# Altium schematic sheet 01_FPGA.SchDoc
size A2
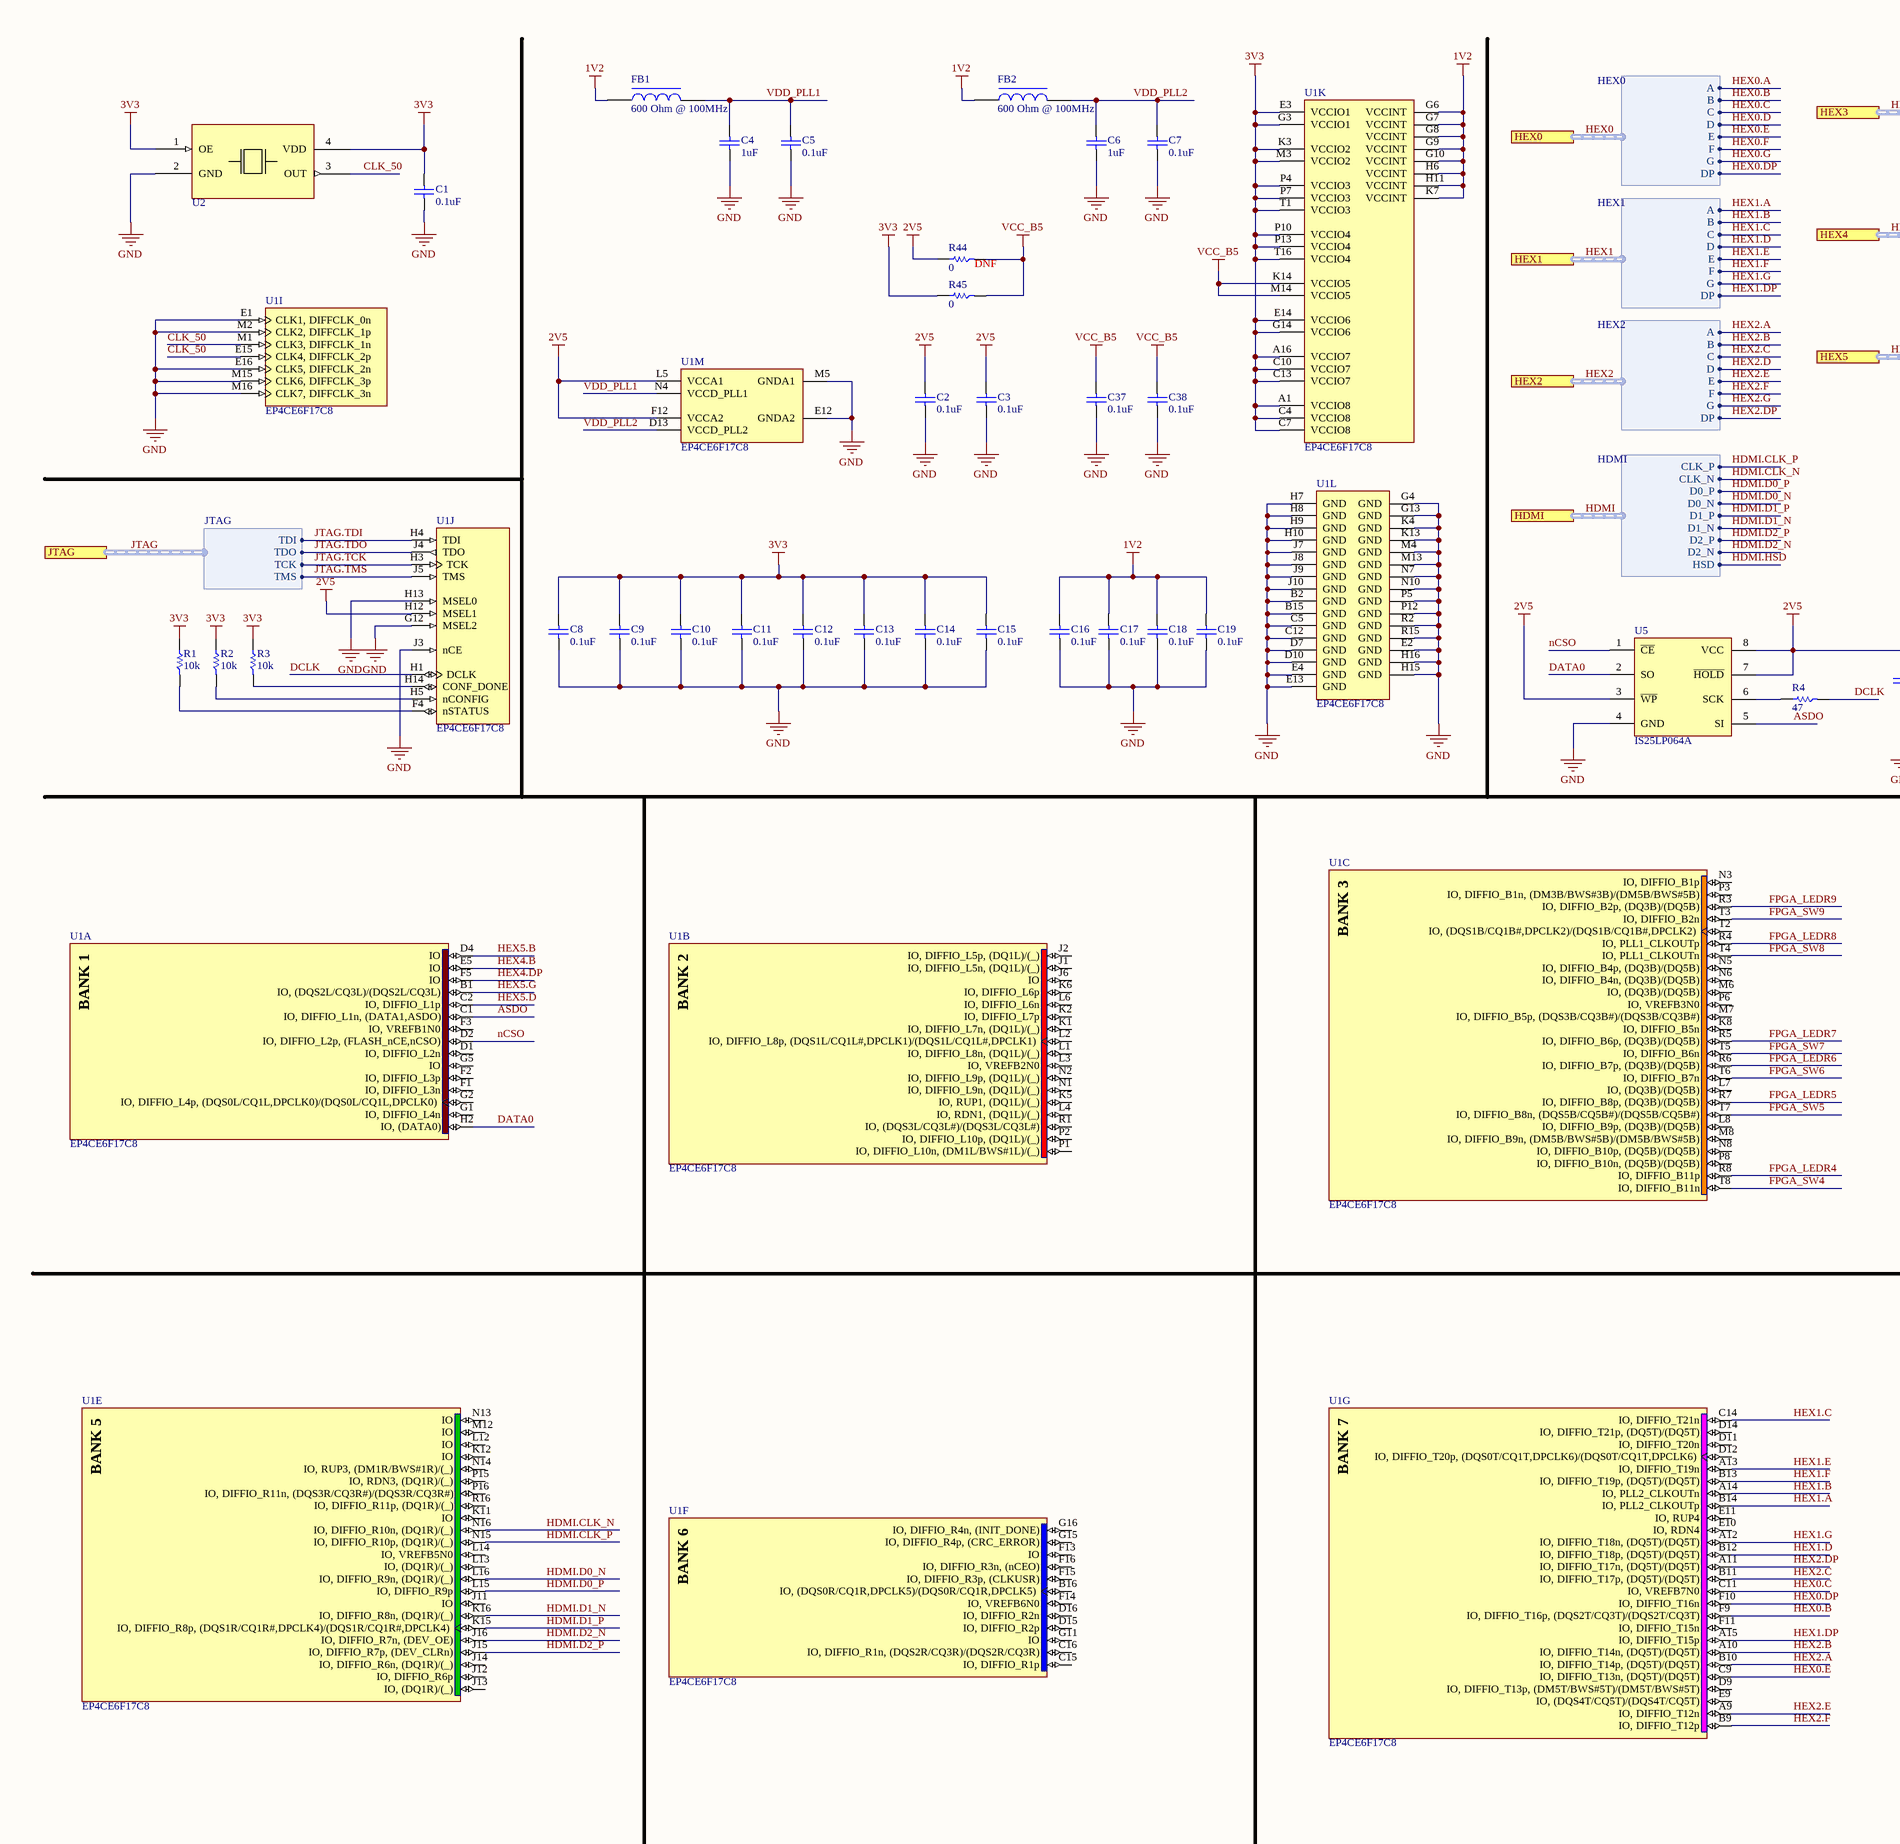
[diagram p0: 01_FPGA.SchDoc, left]
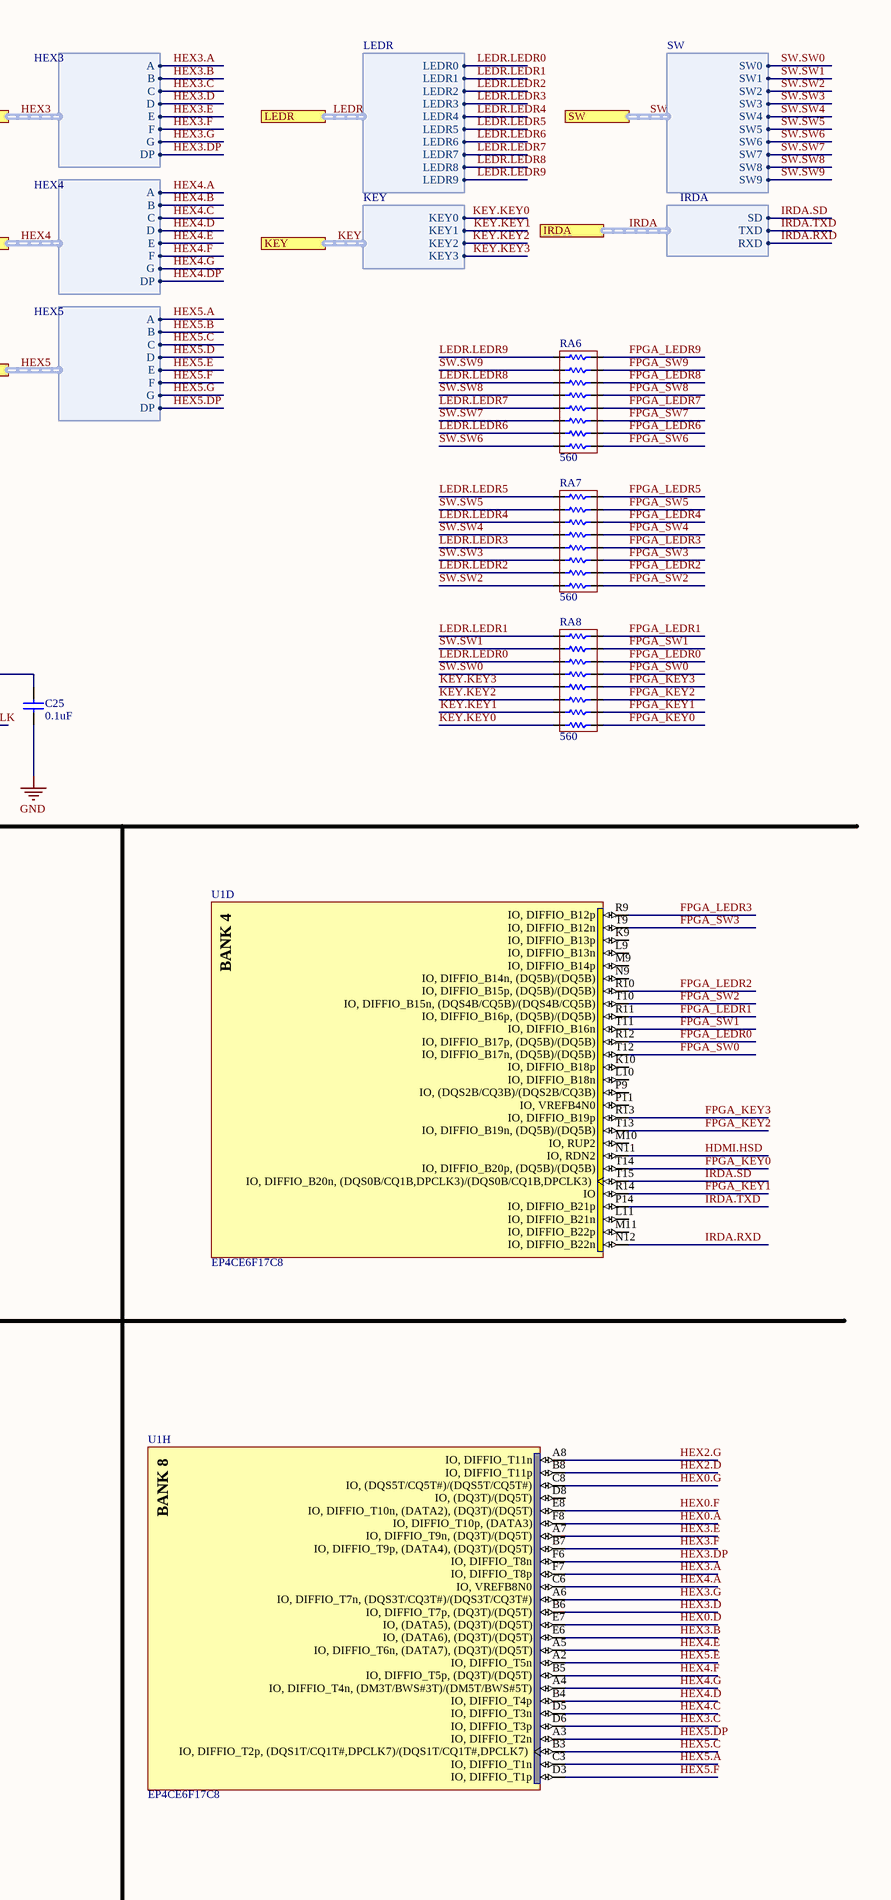
[diagram p1: 01_FPGA.SchDoc, right]

## Parts
C1  0.1uF  [CAP0603R]
C2  0.1uF  [CAP0603R]
C3  0.1uF  [CAP0603R]
C4  1uF  [CAP0603R]
C5  0.1uF  [CAP0603R]
C6  1uF  [CAP0603R]
C7  0.1uF  [CAP0603R]
C8  0.1uF  [CAP0603R]
C9  0.1uF  [CAP0603R]
C10  0.1uF  [CAP0603R]
C11  0.1uF  [CAP0603R]
C12  0.1uF  [CAP0603R]
C13  0.1uF  [CAP0603R]
C14  0.1uF  [CAP0603R]
C15  0.1uF  [CAP0603R]
C16  0.1uF  [CAP0603R]
C17  0.1uF  [CAP0603R]
C18  0.1uF  [CAP0603R]
C19  0.1uF  [CAP0603R]
C25  0.1uF  [CAP0603R]
C37  0.1uF  [CAP0603R]
C38  0.1uF  [CAP0603R]
FB1  600 Ohm @ 100MHz  [RES0805R]
FB2  600 Ohm @ 100MHz  [RES0805R]
R1  10k  [RES0603R]
R2  10k  [RES0603R]
R3  10k  [RES0603R]
R4  47  [RES0603R]
R44  Load: DNF  [RES0402R]  (hidden comment: 0)
R45  0  [RES0402R]
RA6  value 560  [EXB-2HV]  (hidden comment: Resistor Array)
RA7  value 560  [EXB-2HV]  (hidden comment: Resistor Array)
RA8  value 560  [EXB-2HV]  (hidden comment: Resistor Array)
U1  EP4CE6F17C8  [FBGA256]  (parts A,B,C,D,E,F,G,H,I,J,K,L,M of 13)
U2  Oscillator  [CRYSTAL_7x5]  (value not drawn)
U5  IS25LP064A  [SOIC-8]

## Ports
HDMI (harness HDMI), HEX0 (harness HEX0), HEX1 (harness HEX1), HEX2 (harness HEX2), HEX3 (harness HEX3), HEX4 (harness HEX4), HEX5 (harness HEX5), IRDA (harness IRDA), JTAG (harness JTAG), KEY (harness KEY), LEDR (harness LEDR), SW (harness SW)

## Harnesses
JTAG: TDI, TDO, TCK, TMS
LEDR: LEDR0, LEDR1, LEDR2, LEDR3, LEDR4, LEDR5, LEDR6, LEDR7, LEDR8, LEDR9
SW: SW0, SW1, SW2, SW3, SW4, SW5, SW6, SW7, SW8, SW9
KEY: KEY0, KEY1, KEY2, KEY3
HEX0: A, B, C, D, E, F, G, DP
HEX1: A, B, C, D, E, F, G, DP
HEX2: A, B, C, D, E, F, G, DP
HEX3: A, B, C, D, E, F, G, DP
HEX4: A, B, C, D, E, F, G, DP
HEX5: A, B, C, D, E, F, G, DP
HDMI: CLK_P, CLK_N, D0_P, D0_N, D1_P, D1_N, D2_P, D2_N, HSD
IRDA: SD, TXD, RXD

## Nets
1V2: C16.1 C17.1 C18.1 C19.1 FB1.1 FB2.1 U1.G6(VCCINT) U1.G7(VCCINT) U1.G8(VCCINT) U1.G9(VCCINT) U1.G10(VCCINT) U1.H6(VCCINT) U1.H11(VCCINT) U1.K7(VCCINT)
2V5: C2.1 C3.1 C25.1 R44.2 U1.F12(VCCA2) U1.H12(MSEL1) U1.L5(VCCA1) U5.3(~{WP}) U5.7(~{HOLD}) U5.8(VCC)
3V3: C1.1 C8.1 C9.1 C10.1 C11.1 C12.1 C13.1 C14.1 C15.1 R1.2 R2.2 R3.2 R45.2 U1.A1(VCCIO8) U1.A16(VCCIO7) U1.C4(VCCIO8) U1.C7(VCCIO8) U1.C10(VCCIO7) U1.C13(VCCIO7) U1.E3(VCCIO1) U1.E14(VCCIO6) U1.G3(VCCIO1) U1.G14(VCCIO6) U1.K3(VCCIO2) U1.M3(VCCIO2) U1.P4(VCCIO3) U1.P7(VCCIO3) U1.P10(VCCIO4) U1.P13(VCCIO4) U1.T1(VCCIO3) U1.T16(VCCIO4) U2.1(OE) U2.4(VDD)
GND: C1.2 C2.2 C3.2 C4.2 C5.2 C6.2 C7.2 C8.2 C9.2 C10.2 C11.2 C12.2 C13.2 C14.2 C15.2 C16.2 C17.2 C18.2 C19.2 C25.2 C37.2 C38.2 U1.B2(GND) U1.B15(GND) U1.C5(GND) U1.C12(GND) U1.D7(GND) U1.D10(GND) U1.E1(CLK1,_DIFFCLK_0n) U1.E2(GND) U1.E4(GND) U1.E12(GNDA2) U1.E13(GND) U1.E16(CLK5,_DIFFCLK_2n) U1.G4(GND) U1.G12(MSEL2) U1.G13(GND) U1.H7(GND) U1.H8(GND) U1.H9(GND) U1.H10(GND) U1.H13(MSEL0) U1.H15(GND) U1.H16(GND) U1.J3(nCE) U1.J7(GND) U1.J8(GND) U1.J9(GND) U1.J10(GND) U1.K4(GND) U1.K13(GND) U1.M2(CLK2,_DIFFCLK_1p) U1.M4(GND) U1.M5(GNDA1) U1.M13(GND) U1.M15(CLK6,_DIFFCLK_3p) U1.M16(CLK7,_DIFFCLK_3n) U1.N7(GND) U1.N10(GND) U1.P5(GND) U1.P12(GND) U1.R2(GND) U1.R15(GND) U2.2(GND) U5.4(GND)
VCC_B5: C37.1 C38.1 R44.1 R45.1 U1.K14(VCCIO5) U1.M14(VCCIO5)
ASDO: U1.C1(IO,_DIFFIO_L1n,_(DATA1,ASDO)) U5.5(SI)
CLK_50: U1.E15(CLK4,_DIFFCLK_2p) U1.M1(CLK3,_DIFFCLK_1n) U2.3(OUT)
DATA0: U1.H2(IO,_(DATA0)) U5.2(SO)
DCLK: R4.1 U1.H1(DCLK)
FPGA_KEY0: RA8.9 U1.T14(IO,_DIFFIO_B20p,_(DQ5B)/(DQ5B))
FPGA_KEY1: RA8.10 U1.R14(IO)
FPGA_KEY2: RA8.11 U1.T13(IO,_DIFFIO_B19n,_(DQ5B)/(DQ5B))
FPGA_KEY3: RA8.12 U1.R13(IO,_DIFFIO_B19p)
FPGA_LEDR0: RA8.14 U1.R12(IO,_DIFFIO_B17p,_(DQ5B)/(DQ5B))
FPGA_LEDR1: RA8.16 U1.R11(IO,_DIFFIO_B16p,_(DQ5B)/(DQ5B))
FPGA_LEDR2: RA7.10 U1.R10(IO,_DIFFIO_B15p,_(DQ5B)/(DQ5B))
FPGA_LEDR3: RA7.12 U1.R9(IO,_DIFFIO_B12p)
FPGA_LEDR4: RA7.14 U1.R8(IO,_DIFFIO_B11p)
FPGA_LEDR5: RA7.16 U1.R7(IO,_DIFFIO_B8p,_(DQ3B)/(DQ5B))
FPGA_LEDR6: RA6.10 U1.R6(IO,_DIFFIO_B7p,_(DQ3B)/(DQ5B))
FPGA_LEDR7: RA6.12 U1.R5(IO,_DIFFIO_B6p,_(DQ3B)/(DQ5B))
FPGA_LEDR8: RA6.14 U1.R4(IO,_PLL1_CLKOUTp)
FPGA_LEDR9: RA6.16 U1.R3(IO,_DIFFIO_B2p,_(DQ3B)/(DQ5B))
FPGA_SW0: RA8.13 U1.T12(IO,_DIFFIO_B17n,_(DQ5B)/(DQ5B))
FPGA_SW1: RA8.15 U1.T11(IO,_DIFFIO_B16n)
FPGA_SW2: RA7.9 U1.T10(IO,_DIFFIO_B15n,_(DQS4B/CQ5B)/(DQS4B/CQ5B))
FPGA_SW3: RA7.11 U1.T9(IO,_DIFFIO_B12n)
FPGA_SW4: RA7.13 U1.T8(IO,_DIFFIO_B11n)
FPGA_SW5: RA7.15 U1.T7(IO,_DIFFIO_B8n,_(DQS5B/CQ5B#)/(DQS5B/CQ5B#))
FPGA_SW6: RA6.9 U1.T6(IO,_DIFFIO_B7n)
FPGA_SW7: RA6.11 U1.T5(IO,_DIFFIO_B6n)
FPGA_SW8: RA6.13 U1.T4(IO,_PLL1_CLKOUTn)
FPGA_SW9: RA6.15 U1.T3(IO,_DIFFIO_B2n)
HDMI.CLK_N: U1.N16(IO,_DIFFIO_R10n,_(DQ1R)/(_)) ; port HDMI.CLK_N
HDMI.CLK_P: U1.N15(IO,_DIFFIO_R10p,_(DQ1R)/(_)) ; port HDMI.CLK_P
HDMI.D0_N: U1.L16(IO,_DIFFIO_R9n,_(DQ1R)/(_)) ; port HDMI.D0_N
HDMI.D0_P: U1.L15(IO,_DIFFIO_R9p) ; port HDMI.D0_P
HDMI.D1_N: U1.K16(IO,_DIFFIO_R8n,_(DQ1R)/(_)) ; port HDMI.D1_N
HDMI.D1_P: U1.K15(IO,_DIFFIO_R8p,_(DQS1R/CQ1R#,DPCLK4)/(DQS1R/CQ1R#,DPCLK4)) ; port HDMI.D1_P
HDMI.D2_N: U1.J16(IO,_DIFFIO_R7n,_(DEV_OE)) ; port HDMI.D2_N
HDMI.D2_P: U1.J15(IO,_DIFFIO_R7p,_(DEV_CLRn)) ; port HDMI.D2_P
HDMI.HSD: U1.N11(IO,_RDN2) ; port HDMI.HSD
HEX0.A: U1.F8(IO,_DIFFIO_T10p,_(DATA3)) ; port HEX0.A
HEX0.B: U1.F9(IO,_DIFFIO_T16p,_(DQS2T/CQ3T)/(DQS2T/CQ3T)) ; port HEX0.B
HEX0.C: U1.C11(IO,_VREFB7N0) ; port HEX0.C
HEX0.D: U1.E7(IO,_(DATA5),_(DQ3T)/(DQ5T)) ; port HEX0.D
HEX0.DP: U1.F10(IO,_DIFFIO_T16n) ; port HEX0.DP
HEX0.E: U1.C9(IO,_DIFFIO_T13n,_(DQ5T)/(DQ5T)) ; port HEX0.E
HEX0.F: U1.E8(IO,_DIFFIO_T10n,_(DATA2),_(DQ3T)/(DQ5T)) ; port HEX0.F
HEX0.G: U1.C8(IO,_(DQS5T/CQ5T#)/(DQS5T/CQ5T#)) ; port HEX0.G
HEX1.A: U1.B14(IO,_PLL2_CLKOUTp) ; port HEX1.A
HEX1.B: U1.A14(IO,_PLL2_CLKOUTn) ; port HEX1.B
HEX1.C: U1.C14(IO,_DIFFIO_T21n) ; port HEX1.C
HEX1.D: U1.B12(IO,_DIFFIO_T18p,_(DQ5T)/(DQ5T)) ; port HEX1.D
HEX1.DP: U1.A15(IO,_DIFFIO_T15p) ; port HEX1.DP
HEX1.E: U1.A13(IO,_DIFFIO_T19n) ; port HEX1.E
HEX1.F: U1.B13(IO,_DIFFIO_T19p,_(DQ5T)/(DQ5T)) ; port HEX1.F
HEX1.G: U1.A12(IO,_DIFFIO_T18n,_(DQ5T)/(DQ5T)) ; port HEX1.G
HEX2.A: U1.B10(IO,_DIFFIO_T14p,_(DQ5T)/(DQ5T)) ; port HEX2.A
HEX2.B: U1.A10(IO,_DIFFIO_T14n,_(DQ5T)/(DQ5T)) ; port HEX2.B
HEX2.C: U1.B11(IO,_DIFFIO_T17p,_(DQ5T)/(DQ5T)) ; port HEX2.C
HEX2.D: U1.B8(IO,_DIFFIO_T11p) ; port HEX2.D
HEX2.DP: U1.A11(IO,_DIFFIO_T17n,_(DQ5T)/(DQ5T)) ; port HEX2.DP
HEX2.E: U1.A9(IO,_DIFFIO_T12n) ; port HEX2.E
HEX2.F: U1.B9(IO,_DIFFIO_T12p) ; port HEX2.F
HEX2.G: U1.A8(IO,_DIFFIO_T11n) ; port HEX2.G
HEX3.A: U1.F7(IO,_DIFFIO_T8p) ; port HEX3.A
HEX3.B: U1.E6(IO,_(DATA6),_(DQ3T)/(DQ5T)) ; port HEX3.B
HEX3.C: U1.D6(IO,_DIFFIO_T3p) ; port HEX3.C
HEX3.D: U1.B6(IO,_DIFFIO_T7p,_(DQ3T)/(DQ5T)) ; port HEX3.D
HEX3.DP: U1.F6(IO,_DIFFIO_T8n) ; port HEX3.DP
HEX3.E: U1.A7(IO,_DIFFIO_T9n,_(DQ3T)/(DQ5T)) ; port HEX3.E
HEX3.F: U1.B7(IO,_DIFFIO_T9p,_(DATA4),_(DQ3T)/(DQ5T)) ; port HEX3.F
HEX3.G: U1.A6(IO,_DIFFIO_T7n,_(DQS3T/CQ3T#)/(DQS3T/CQ3T#)) ; port HEX3.G
HEX4.A: U1.C6(IO,_VREFB8N0) ; port HEX4.A
HEX4.B: U1.E5(IO) ; port HEX4.B
HEX4.C: U1.D5(IO,_DIFFIO_T3n) ; port HEX4.C
HEX4.D: U1.B4(IO,_DIFFIO_T4p) ; port HEX4.D
HEX4.DP: U1.F5(IO) ; port HEX4.DP
HEX4.E: U1.A5(IO,_DIFFIO_T6n,_(DATA7),_(DQ3T)/(DQ5T)) ; port HEX4.E
HEX4.F: U1.B5(IO,_DIFFIO_T5p,_(DQ3T)/(DQ5T)) ; port HEX4.F
HEX4.G: U1.A4(IO,_DIFFIO_T4n,_(DM3T/BWS#3T)/(DM5T/BWS#5T)) ; port HEX4.G
HEX5.A: U1.C3(IO,_DIFFIO_T1n) ; port HEX5.A
HEX5.B: U1.D4(IO) ; port HEX5.B
HEX5.C: U1.B3(IO,_DIFFIO_T2p,_(DQS1T/CQ1T#,DPCLK7)/(DQS1T/CQ1T#,DPCLK7)) ; port HEX5.C
HEX5.D: U1.C2(IO,_DIFFIO_L1p) ; port HEX5.D
HEX5.DP: U1.A3(IO,_DIFFIO_T2n) ; port HEX5.DP
HEX5.E: U1.A2(IO,_DIFFIO_T5n) ; port HEX5.E
HEX5.F: U1.D3(IO,_DIFFIO_T1p) ; port HEX5.F
HEX5.G: U1.B1(IO,_(DQS2L/CQ3L)/(DQS2L/CQ3L)) ; port HEX5.G
IRDA.RXD: U1.N12(IO,_DIFFIO_B22n) ; port IRDA.RXD
IRDA.SD: U1.T15(IO,_DIFFIO_B20n,_(DQS0B/CQ1B,DPCLK3)/(DQS0B/CQ1B,DPCLK3)) ; port IRDA.SD
IRDA.TXD: U1.P14(IO,_DIFFIO_B21p) ; port IRDA.TXD
JTAG.TCK: U1.H3(TCK) ; port JTAG.TCK
JTAG.TDI: U1.H4(TDI) ; port JTAG.TDI
JTAG.TDO: U1.J4(TDO) ; port JTAG.TDO
JTAG.TMS: U1.J5(TMS) ; port JTAG.TMS
KEY.KEY0: RA8.8 ; port KEY.KEY0
KEY.KEY1: RA8.7 ; port KEY.KEY1
KEY.KEY2: RA8.6 ; port KEY.KEY2
KEY.KEY3: RA8.5 ; port KEY.KEY3
LEDR.LEDR0: RA8.3 ; port LEDR.LEDR0
LEDR.LEDR1: RA8.1 ; port LEDR.LEDR1
LEDR.LEDR2: RA7.7 ; port LEDR.LEDR2
LEDR.LEDR3: RA7.5 ; port LEDR.LEDR3
LEDR.LEDR4: RA7.3 ; port LEDR.LEDR4
LEDR.LEDR5: RA7.1 ; port LEDR.LEDR5
LEDR.LEDR6: RA6.7 ; port LEDR.LEDR6
LEDR.LEDR7: RA6.5 ; port LEDR.LEDR7
LEDR.LEDR8: RA6.3 ; port LEDR.LEDR8
LEDR.LEDR9: RA6.1 ; port LEDR.LEDR9
nCSO: U1.D2(IO,_DIFFIO_L2p,_(FLASH_nCE,nCSO)) U5.1(~{CE})
SW.SW0: RA8.4 ; port SW.SW0
SW.SW1: RA8.2 ; port SW.SW1
SW.SW2: RA7.8 ; port SW.SW2
SW.SW3: RA7.6 ; port SW.SW3
SW.SW4: RA7.4 ; port SW.SW4
SW.SW5: RA7.2 ; port SW.SW5
SW.SW6: RA6.8 ; port SW.SW6
SW.SW7: RA6.6 ; port SW.SW7
SW.SW8: RA6.4 ; port SW.SW8
SW.SW9: RA6.2 ; port SW.SW9
VDD_PLL1: C4.1 C5.1 FB1.2 U1.N4(VCCD_PLL1)
VDD_PLL2: C6.1 C7.1 FB2.2 U1.D13(VCCD_PLL2)
NetR1_1: R1.1 U1.F4(nSTATUS)
NetR2_1: R2.1 U1.H5(nCONFIG)
NetR3_1: R3.1 U1.H14(CONF_DONE)
NetR4_2: R4.2 U5.6(SCK)

Not connected (* = marked no-connect by the designer): U1 B16(IO,_(DQS0R/CQ1R,DPCLK5)/(DQS0R/CQ1R,DPCLK5)) C15(IO,_DIFFIO_R1p) C16(IO,_DIFFIO_R1n,_(DQS2R/CQ3R)/(DQS2R/CQ3R)) D1(IO,_DIFFIO_L2n) D8(IO,_(DQ3T)/(DQ5T)) D9(IO,_DIFFIO_T13p,_(DM5T/BWS#5T)/(DM5T/BWS#5T)) D11(IO,_DIFFIO_T20n) D12(IO,_DIFFIO_T20p,_(DQS0T/CQ1T,DPCLK6)/(DQS0T/CQ1T,DPCLK6)) D14(IO,_DIFFIO_T21p,_(DQ5T)/(DQ5T)) D15(IO,_DIFFIO_R2p) D16(IO,_DIFFIO_R2n) E9(IO,_(DQS4T/CQ5T)/(DQS4T/CQ5T)) E10(IO,_RDN4) E11(IO,_RUP4) F1(IO,_DIFFIO_L3n) F2(IO,_DIFFIO_L3p) F3(IO,_VREFB1N0) F11(IO,_DIFFIO_T15n) F13(IO) F14(IO,_VREFB6N0) F15(IO,_DIFFIO_R3p,_(CLKUSR)) F16(IO,_DIFFIO_R3n,_(nCEO)) G1(IO,_DIFFIO_L4n) G2(IO,_DIFFIO_L4p,_(DQS0L/CQ1L,DPCLK0)/(DQS0L/CQ1L,DPCLK0)) G5(IO) G11(IO) G15(IO,_DIFFIO_R4p,_(CRC_ERROR)) G16(IO,_DIFFIO_R4n,_(INIT_DONE)) J1(IO,_DIFFIO_L5n,_(DQ1L)/(_)) J2(IO,_DIFFIO_L5p,_(DQ1L)/(_)) J6(IO) J11(IO) J12(IO,_DIFFIO_R6p) J13(IO,_(DQ1R)/(_)) J14(IO,_DIFFIO_R6n,_(DQ1R)/(_)) K1(IO,_DIFFIO_L7n,_(DQ1L)/(_)) K2(IO,_DIFFIO_L7p) K5(IO,_RUP1,_(DQ1L)/(_)) K6(IO,_DIFFIO_L6p) K8(IO,_DIFFIO_B5n) K9(IO,_DIFFIO_B13p) K10(IO,_DIFFIO_B18p) K11(IO) K12(IO) L1(IO,_DIFFIO_L8n,_(DQ1L)/(_)) L2(IO,_DIFFIO_L8p,_(DQS1L/CQ1L#,DPCLK1)/(DQS1L/CQ1L#,DPCLK1)) L3(IO,_VREFB2N0) L4(IO,_RDN1,_(DQ1L)/(_)) L6(IO,_DIFFIO_L6n) L7(IO,_(DQ3B)/(DQ5B)) L8(IO,_DIFFIO_B9p,_(DQ3B)/(DQ5B)) L9(IO,_DIFFIO_B13n) L10(IO,_DIFFIO_B18n) L11(IO,_DIFFIO_B21n) L12(IO) L13(IO,_(DQ1R)/(_)) L14(IO,_VREFB5N0) M6(IO,_(DQ3B)/(DQ5B)) M7(IO,_DIFFIO_B5p,_(DQS3B/CQ3B#)/(DQS3B/CQ3B#)) M8(IO,_DIFFIO_B9n,_(DM5B/BWS#5B)/(DM5B/BWS#5B)) M9(IO,_DIFFIO_B14p) M10(IO,_RUP2) M11(IO,_DIFFIO_B22p) M12(IO) N1(IO,_DIFFIO_L9n,_(DQ1L)/(_)) N2(IO,_DIFFIO_L9p,_(DQ1L)/(_)) N3(IO,_DIFFIO_B1p) N5(IO,_DIFFIO_B4p,_(DQ3B)/(DQ5B)) N6(IO,_DIFFIO_B4n,_(DQ3B)/(DQ5B)) N8(IO,_DIFFIO_B10p,_(DQ5B)/(DQ5B)) N9(IO,_DIFFIO_B14n,_(DQ5B)/(DQ5B)) N13(IO) N14(IO,_RUP3,_(DM1R/BWS#1R)/(_)) P1(IO,_DIFFIO_L10n,_(DM1L/BWS#1L)/(_)) P2(IO,_DIFFIO_L10p,_(DQ1L)/(_)) P3(IO,_DIFFIO_B1n,_(DM3B/BWS#3B)/(DM5B/BWS#5B)) P6(IO,_VREFB3N0) P8(IO,_DIFFIO_B10n,_(DQ5B)/(DQ5B)) P9(IO,_(DQS2B/CQ3B)/(DQS2B/CQ3B)) P11(IO,_VREFB4N0) P15(IO,_RDN3,_(DQ1R)/(_)) P16(IO,_DIFFIO_R11n,_(DQS3R/CQ3R#)/(DQS3R/CQ3R#)) R1(IO,_(DQS3L/CQ3L#)/(DQS3L/CQ3L#)) R16(IO,_DIFFIO_R11p,_(DQ1R)/(_)) T2(IO,_(DQS1B/CQ1B#,DPCLK2)/(DQS1B/CQ1B#,DPCLK2))

## Buses and harness runs
harness HDMI = port HDMI
harness HEX0 = port HEX0
harness HEX1 = port HEX1
harness HEX2 = port HEX2
harness HEX3 = port HEX3
harness HEX4 = port HEX4
harness HEX5 = port HEX5
harness IRDA = port IRDA
harness JTAG = port JTAG
harness KEY = port KEY
harness LEDR = port LEDR
harness SW = port SW

## Notes on the sheet
- (in symbol EP4CE6F17C8, part A) BANK 1
- (in symbol EP4CE6F17C8, part B) BANK 2
- (in symbol EP4CE6F17C8, part C) BANK 3
- (in symbol EP4CE6F17C8, part D) BANK 4
- (in symbol EP4CE6F17C8, part E) BANK 5
- (in symbol EP4CE6F17C8, part F) BANK 6
- (in symbol EP4CE6F17C8, part G) BANK 7
- (in symbol EP4CE6F17C8, part H) BANK 8

## Library data of the parts
C1-C19 C25 C37 C38 = C: Capacitor; Class I: Passive; Load: YES; Revision: July-2002: Re-released for DXP Platform.; Supplier 1: Digi-Key; Mount: SMD
  C1-C3 C5 C7-C19 C25 C37 C38: Supplier Part Number 1: 311-3560-1-ND; Value: 0.1uF
  C4 C6: Supplier Part Number 1: 587-1242-1-ND; Value: 1uF
FB1 FB2 = Ferrite_Bead: Ferrite Bead; Load: YES; Supplier 1: Digi-Key; Supplier Part Number 1: 445-172908-1-ND; Value: 600 Ohm @ 100MHz; Mount: SMD
R1-R4 R45 = R: Resistor; Load: YES; Mount: SMD; Supplier 1: Digi-Key
  R1-R3: Supplier Part Number 1: 311-10.0KHRCT-ND; Value: 10k
  R4: Supplier Part Number 1: 311-47GRCT-ND; Value: 47
  R45: Supplier Part Number 1: 311-0.0LRCT-ND; Value: 0
R44 = R: Resistor; Mount: SMD; Supplier 1: Digi-Key; Supplier Part Number 1: 311-0.0LRCT-ND; Value: 0
RA6-RA8 = Res Array: Resistor Array with 8 Isolated Resistors; Num of Resistors: 8; 01 Created By: Thomas Harper (12/03/2017); Load: YES; Type: Isolated; Published: 12-Mar-2018; Publisher: MUEEC; Supplier 1: Digi-Key; Supplier Part Number 1: Y1561CT-ND; Mount: SMD
U1 = EP4CE6F17C8: Cyclone IV Family FPGA, 2V Core, 179 I/O Pins, 2 PLLs, 256-Pin FBGA, Speed Grade 8, Commercial Grade; Load: YES; Published: 3-May-2010; DatasheetVersion: ver1.2, Mar-2010; PackageVersion: ver16.0, Dec-2009; PackageReference: FBGA256; Publisher: Altium Limited; PackageDescription: 256-Ball FineLine Ball Grid Array (FBGA256) - Option 1 - Wire Bond; Supplier 1: Digi-Key; Supplier Part Number 1: 544-2828-ND; Code_JEDEC: MS-034-AAF-1; Code_IPC: BGA100P16X16-256; ComponentLink1Description: Manufacturer Link; ComponentLink1URL: http://www.altera.com/; ComponentLink2Description: Handbook; ComponentLink2URL: http://www.altera.com/literature/hb/cyclone-iv/cyclone4-handbook.pdf; ComponentLink3Description: Pinout Specification; ComponentLink3URL: http://www.altera.com/literature/lit-dp.jsp?category=cyc%204&showspreadsheet=y; ComponentLink4Description: Packaging Specification; ComponentLink4URL: http://www.altera.com/literature/ds/dspkg.pdf; Mount: SMD
U2 = CLK_50M: OSC 50MHZ 3.3V SMD; Load: YES; Supplier 1: Digi-Key; Supplier Part Number 1: 535-9330-1-ND; Mount: SMD
U5 = IS25LP064A: 64Mb Serial Flash Memory; Load: YES; Supplier 1: Digi-Key; Supplier Part Number 1: 706-1440-5-ND; Mount: SMD